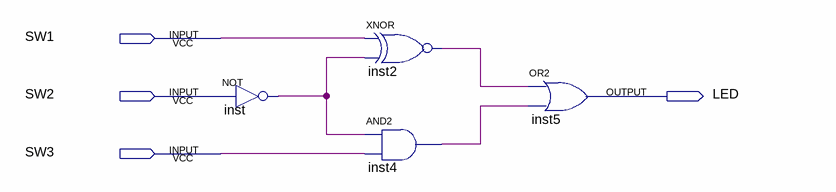
[diagram p0: schematic sheet]
// Quartus schematic Block_A.bdf as structural Verilog: 4 symbols, 4 pins
module Block_A (
  input  SW1,
  input  SW2,
  input  SW3,
  output LED
);

  wire inst2_out, inst4_out, inst_out;

  not inst (inst_out, SW2);
  xnor inst2 (inst2_out, SW1, inst_out);
  and inst4 (inst4_out, inst_out, SW3);
  or inst5 (LED, inst2_out, inst4_out);
endmodule
